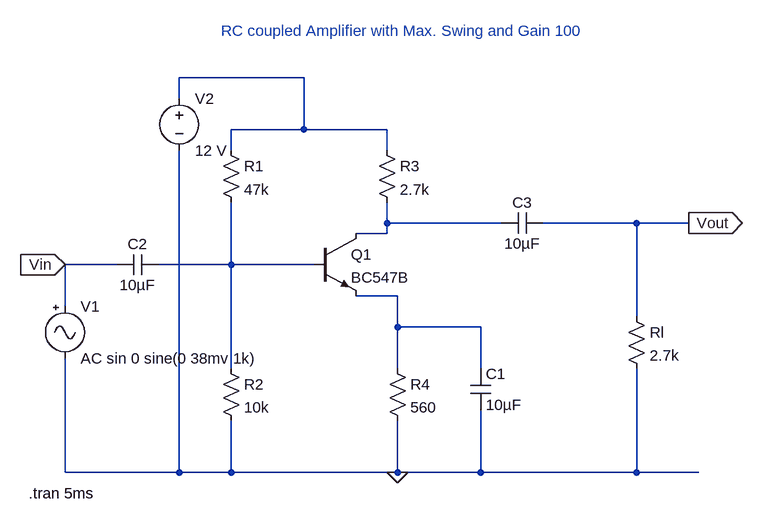
[diagram p0: schematic rcCoupleAmp2.asc]
rcCoupleAmp2.asc, the LTspice schematic file:
Version 4
SHEET 1 880 680
WIRE -576 -352 -768 -352
WIRE -768 -320 -768 -352
WIRE -576 -272 -576 -352
WIRE -576 -272 -688 -272
WIRE -448 -272 -576 -272
WIRE -688 -240 -688 -272
WIRE -448 -240 -448 -272
WIRE -448 -128 -448 -160
WIRE -272 -128 -448 -128
WIRE -64 -128 -208 -128
WIRE 16 -128 -64 -128
WIRE -448 -112 -448 -128
WIRE -448 -112 -496 -112
WIRE -864 -64 -944 -64
WIRE -688 -64 -688 -160
WIRE -688 -64 -800 -64
WIRE -560 -64 -688 -64
WIRE -432 -16 -496 -16
WIRE -944 0 -944 -64
WIRE -64 16 -64 -128
WIRE -432 32 -432 -16
WIRE -304 32 -432 32
WIRE -688 96 -688 -64
WIRE -432 96 -432 32
WIRE -304 96 -304 32
WIRE -944 256 -944 80
WIRE -768 256 -768 -240
WIRE -768 256 -944 256
WIRE -688 256 -688 176
WIRE -688 256 -768 256
WIRE -432 256 -432 176
WIRE -432 256 -688 256
WIRE -304 256 -304 160
WIRE -304 256 -432 256
WIRE -64 256 -64 96
WIRE -64 256 -304 256
WIRE 32 256 -64 256
FLAG -432 256 0
FLAG -944 -64 Vin
IOPIN -944 -64 In
FLAG 16 -128 Vout
IOPIN 16 -128 Out
SYMBOL Misc\\signal -944 -16 R0
WINDOW 123 0 0 Left 0
WINDOW 39 0 0 Left 0
SYMATTR InstName V1
SYMATTR Value AC sin 0 sine(0 38mv 1k)
SYMBOL npn -560 -112 R0
SYMATTR InstName Q1
SYMATTR Value BC547B
SYMBOL res -704 -256 R0
SYMATTR InstName R1
SYMATTR Value 47k
SYMBOL res -704 80 R0
SYMATTR InstName R2
SYMATTR Value 10k
SYMBOL res -464 -256 R0
SYMATTR InstName R3
SYMATTR Value 2.7k
SYMBOL res -448 80 R0
SYMATTR InstName R4
SYMATTR Value 560
SYMBOL cap -320 96 R0
SYMATTR InstName C1
SYMATTR Value 10µF
SYMBOL cap -800 -80 R90
WINDOW 0 0 32 VBottom 2
WINDOW 3 32 32 VTop 2
SYMATTR InstName C2
SYMATTR Value 10µF
SYMBOL cap -208 -144 R90
WINDOW 0 0 32 VBottom 2
WINDOW 3 32 32 VTop 2
SYMATTR InstName C3
SYMATTR Value 10µF
SYMBOL voltage -768 -336 R0
SYMATTR InstName V2
SYMATTR Value 12 V
SYMBOL res -80 0 R0
SYMATTR InstName Rl
SYMATTR Value 2.7k
TEXT -1000 288 Left 2 !.tran 5ms
TEXT -704 -424 Left 2 ;RC coupled Amplifier with Max. Swing and Gain 100

The netlist it stands for:
* rcCoupleAmp2.asc
V1 Vin 0 AC sin 0 sine(0 38mv 1k)
Q1 N002 N003 N004 0 BC547B
R1 N001 N003 47k
R2 N003 0 10k
R3 N001 N002 2.7k
R4 N004 0 560
C1 N004 0 10µF
C2 N003 Vin 10µF
C3 Vout N002 10µF
V2 N001 0 12 V
Rl Vout 0 2.7k
.model NPN NPN
.model PNP PNP
.lib standard.bjt
.tran 5ms
* RC coupled Amplifier with Max. Swing and Gain 100
.backanno
.end